# Altium schematic sheet FirstProject.SchDoc
size A
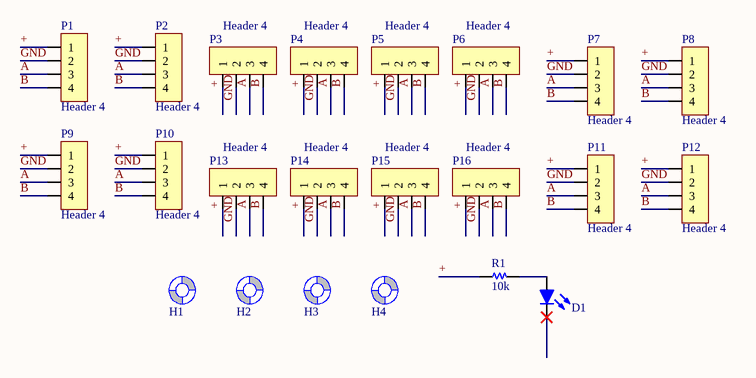
[diagram p0: FirstProject.SchDoc]

## Parts
D1  Led  [Led 0603 - red]  (value not drawn)
H1  Screw Hole  [SCREW/3.0/6.0]  (value not drawn)  (no BOM)
H2  Screw Hole  [SCREW/3.0/6.0]  (value not drawn)  (no BOM)
H3  Screw Hole  [SCREW/3.0/6.0]  (value not drawn)  (no BOM)
H4  Screw Hole  [SCREW/3.0/6.0]  (value not drawn)  (no BOM)
P1  Header 4  [HDR/Header/4/BOX]
P2  Header 4  [HDR/Header/4/BOX]
P3  Header 4  [HDR/Terminal/4/RA]
P4  Header 4  [HDR/Terminal/4/RA]
P5  Header 4  [HDR/Terminal/4/RA]
P6  Header 4  [HDR/Terminal/4/RA]
P7  Header 4  [HDR/Header/4/BOX]
P8  Header 4  [HDR/Header/4/BOX]
P9  Header 4  [HDR/Header/4/BOX]
P10  Header 4  [HDR/Header/4/BOX]
P11  Header 4  [HDR/Header/4/BOX]
P12  Header 4  [HDR/Header/4/BOX]
P13  Header 4  [HDR/Terminal/4/RA]
P14  Header 4  [HDR/Terminal/4/RA]
P15  Header 4  [HDR/Terminal/4/RA]
P16  Header 4  [HDR/Terminal/4/RA]
R1  10k  [R 0805]

## Nets
+: P1.1 P2.1 P3.1 P4.1 P5.1 P6.1 P7.1 P8.1 P9.1 P10.1 P11.1 P12.1 P13.1 P14.1 P15.1 P16.1 R1.1
A: P1.3 P2.3 P3.3 P4.3 P5.3 P6.3 P7.3 P8.3 P9.3 P10.3 P11.3 P12.3 P13.3 P14.3 P15.3 P16.3
B: P1.4 P2.4 P3.4 P4.4 P5.4 P6.4 P7.4 P8.4 P9.4 P10.4 P11.4 P12.4 P13.4 P14.4 P15.4 P16.4
GND: P1.2 P2.2 P3.2 P4.2 P5.2 P6.2 P7.2 P8.2 P9.2 P10.2 P11.2 P12.2 P13.2 P14.2 P15.2 P16.2
NetD1_1: D1.1(A) R1.2

Not connected (* = marked no-connect by the designer): D1 2(K)*; H1 1(Screw); H2 1(Screw); H3 1(Screw); H4 1(Screw)

## Library data of the parts
D1 = Led: Typical LED
P1-P16 = Header 4: Header, 4-Pin
R1 = Resistor
H1-H4 = Screw Hole: TYPE: NO-BOM; UNIT PRICE: 0